# EAGLE schematic 5HP_Datalogger (EAGLE 8.3.0)
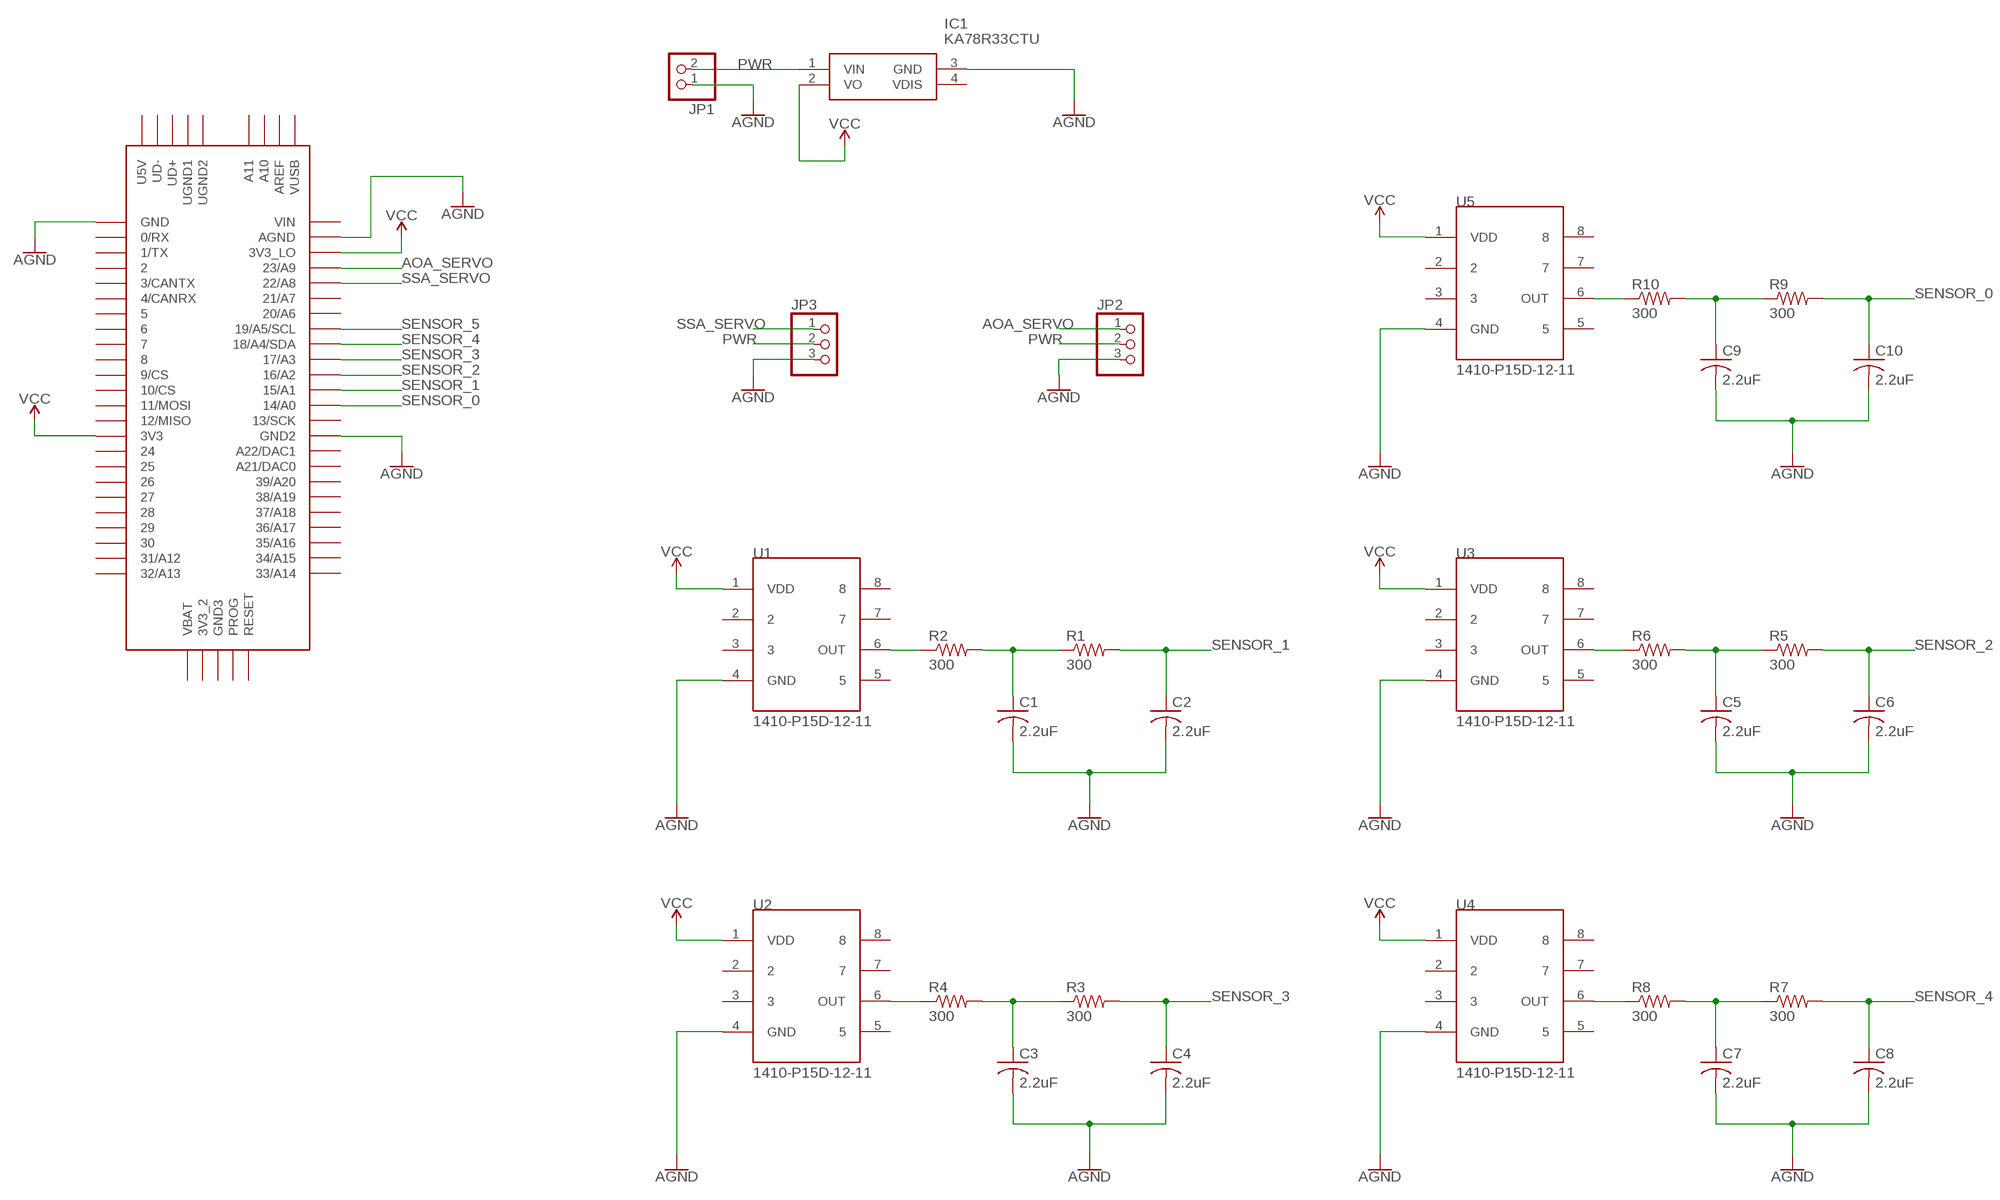
[diagram p0: schematic, sheet 1]

## Parts
C1  2.2uF  C-US075-032X103  [C075-032X103]
C2  2.2uF  C-US075-032X103  [C075-032X103]
C3  2.2uF  C-US075-032X103  [C075-032X103]
C4  2.2uF  C-US075-032X103  [C075-032X103]
C5  2.2uF  C-US075-032X103  [C075-032X103]
C6  2.2uF  C-US075-032X103  [C075-032X103]
C7  2.2uF  C-US075-032X103  [C075-032X103]
C8  2.2uF  C-US075-032X103  [C075-032X103]
C9  2.2uF  C-US075-032X103  [C075-032X103]
C10  2.2uF  C-US075-032X103  [C075-032X103]
IC1  KA78R33CTU  [TO254P470X1000X1960-4P]
JP1  PINHD-1X2  [1X02]
JP2  PINHD-1X3  [1X03]
JP3  PINHD-1X3  [1X03]
R1  300  R-US_0207/10  [0207/10]
R2  300  R-US_0207/10  [0207/10]
R3  300  R-US_0207/10  [0207/10]
R4  300  R-US_0207/10  [0207/10]
R5  300  R-US_0207/10  [0207/10]
R6  300  R-US_0207/10  [0207/10]
R7  300  R-US_0207/10  [0207/10]
R8  300  R-US_0207/10  [0207/10]
R9  300  R-US_0207/10  [0207/10]
R10  300  R-US_0207/10  [0207/10]
U1  1410-P15D-12-11  [1410-P15D-12-11]
U2  1410-P15D-12-11  [1410-P15D-12-11]
U3  1410-P15D-12-11  [1410-P15D-12-11]
U4  1410-P15D-12-11  [1410-P15D-12-11]
U5  1410-P15D-12-11  [1410-P15D-12-11]
U$2  TEENSY_3.5/3.6  [TEENSY_3.5/3.6]

## Nets
AGND: C1.2 C2.2 C3.2 C4.2 C5.2 C6.2 C7.2 C8.2 C9.2 C10.2 IC1.3(GND) JP1.1 JP2.3 JP3.3 U1.4(GND) U2.4(GND) U3.4(GND) U4.4(GND) U5.4(GND) U$2.AGND U$2.GND U$2.GND2
AOA_SERVO: JP2.1 U$2.23/A9
N$1: R2.1 U1.6(OUT)
N$2: C1.1 R1.1 R2.2
N$3: R4.1 U2.6(OUT)
N$4: C3.1 R3.1 R4.2
N$5: R6.1 U3.6(OUT)
N$6: C5.1 R5.1 R6.2
N$7: R8.1 U4.6(OUT)
N$8: C7.1 R7.1 R8.2
N$9: R10.1 U5.6(OUT)
N$10: C9.1 R9.1 R10.2
PWR: IC1.1(VIN) JP1.2 JP2.2 JP3.2
SENSOR_0: C10.1 R9.2 U$2.14/A0
SENSOR_1: C2.1 R1.2 U$2.15/A1
SENSOR_2: C6.1 R5.2 U$2.16/A2
SENSOR_3: C4.1 R3.2 U$2.17/A3
SENSOR_4: C8.1 R7.2 U$2.18/A4/SDA
SENSOR_5: U$2.19/A5/SCL
SSA_SERVO: JP3.1 U$2.22/A8
VCC: IC1.2(VO) U1.1(VDD) U2.1(VDD) U3.1(VDD) U4.1(VDD) U5.1(VDD) U$2.3V3 U$2.3V3_LO
Unconnected: IC1.4(VDIS) U1.2 U1.3 U1.5 U1.7 U1.8 U2.2 U2.3 U2.5 U2.7 U2.8 U3.2 U3.3 U3.5 U3.7 U3.8 U4.2 U4.3 U4.5 U4.7 U4.8 U5.2 U5.3 U5.5 U5.7 U5.8 U$2.0/RX U$2.1/TX U$2.2 U$2.3/CANTX U$2.3V3_2 U$2.4/CANRX U$2.5 U$2.6 U$2.7 U$2.8 U$2.9/CS U$2.10/CS U$2.11/MOSI U$2.12/MISO U$2.13/SCK U$2.20/A6 U$2.21/A7 U$2.21/DAC0(A21/DAC0) U$2.24 U$2.25 U$2.26 U$2.27 U$2.28 U$2.29 U$2.30 U$2.31/A12 U$2.32/A13 U$2.33/A14 U$2.34/A15 U$2.35/A16 U$2.36/A17 U$2.37/A18 U$2.38/A19 U$2.39/A20 U$2.A10 U$2.A11 U$2.A22/DAC1 U$2.AREF U$2.GND3 U$2.PROG U$2.RESET U$2.U5V U$2.UD+ U$2.UD- U$2.UGND1 U$2.UGND2 U$2.VBAT U$2.VIN U$2.VUSB

## Library data of the parts
C1-C10 = adafruit:C-US: CAPACITOR, American symbol
IC1 = KA78R33CTU:KA78R33CTU: IC, Fairchild, KA78R33CTU KA78R33CTU, Low Dropout Voltage Regulator, 1A, 3.38 V, 4 10 Vin, 15W, 4-Pin TO-220F Source: Datasheet <http://docs-europe.electrocomponents.com/webdocs/12cf/0900766b812cfc0c.pdf>; ARROW_PART_NUMBER: KA78R33CTU; ARROW_PRICE/STOCK: http://uk.rs-online.com/web/p/products/8064368; DESCRIPTION: IC, Fairchild, KA78R33CTU KA78R33CTU, Low Dropout Voltage Regulator, 1A, 3.38 V, 4 10 Vin, 15W, 4-Pin TO-220F; HEIGHT: 4.7mm; MANUFACTURER_NAME: Fairchild Semiconductor; MANUFACTURER_PART_NUMBER: KA78R33CTU; RS_PART_NUMBER: 8064368; RS_PRICE/STOCK: http://uk.rs-online.com/web/p/products/8064368
JP1 = pinhead:PINHD-1X2: PIN HEADER
JP2 JP3 = pinhead:PINHD-1X3: PIN HEADER
R1-R10 = adafruit:R-US_: RESISTOR, American symbol
U1-U5 = 1410-P15D-12-11:1410-P15D-12-11: 1410-P15D-12-11: Surface mountable pressure sensor package with a compensated analog output suitable for ultra-low pressure sensing applications.
U$2 = Teensy356:TEENSY_3.5/3.6